# Altium schematic sheet EXT_SEC.SchDoc
size A2
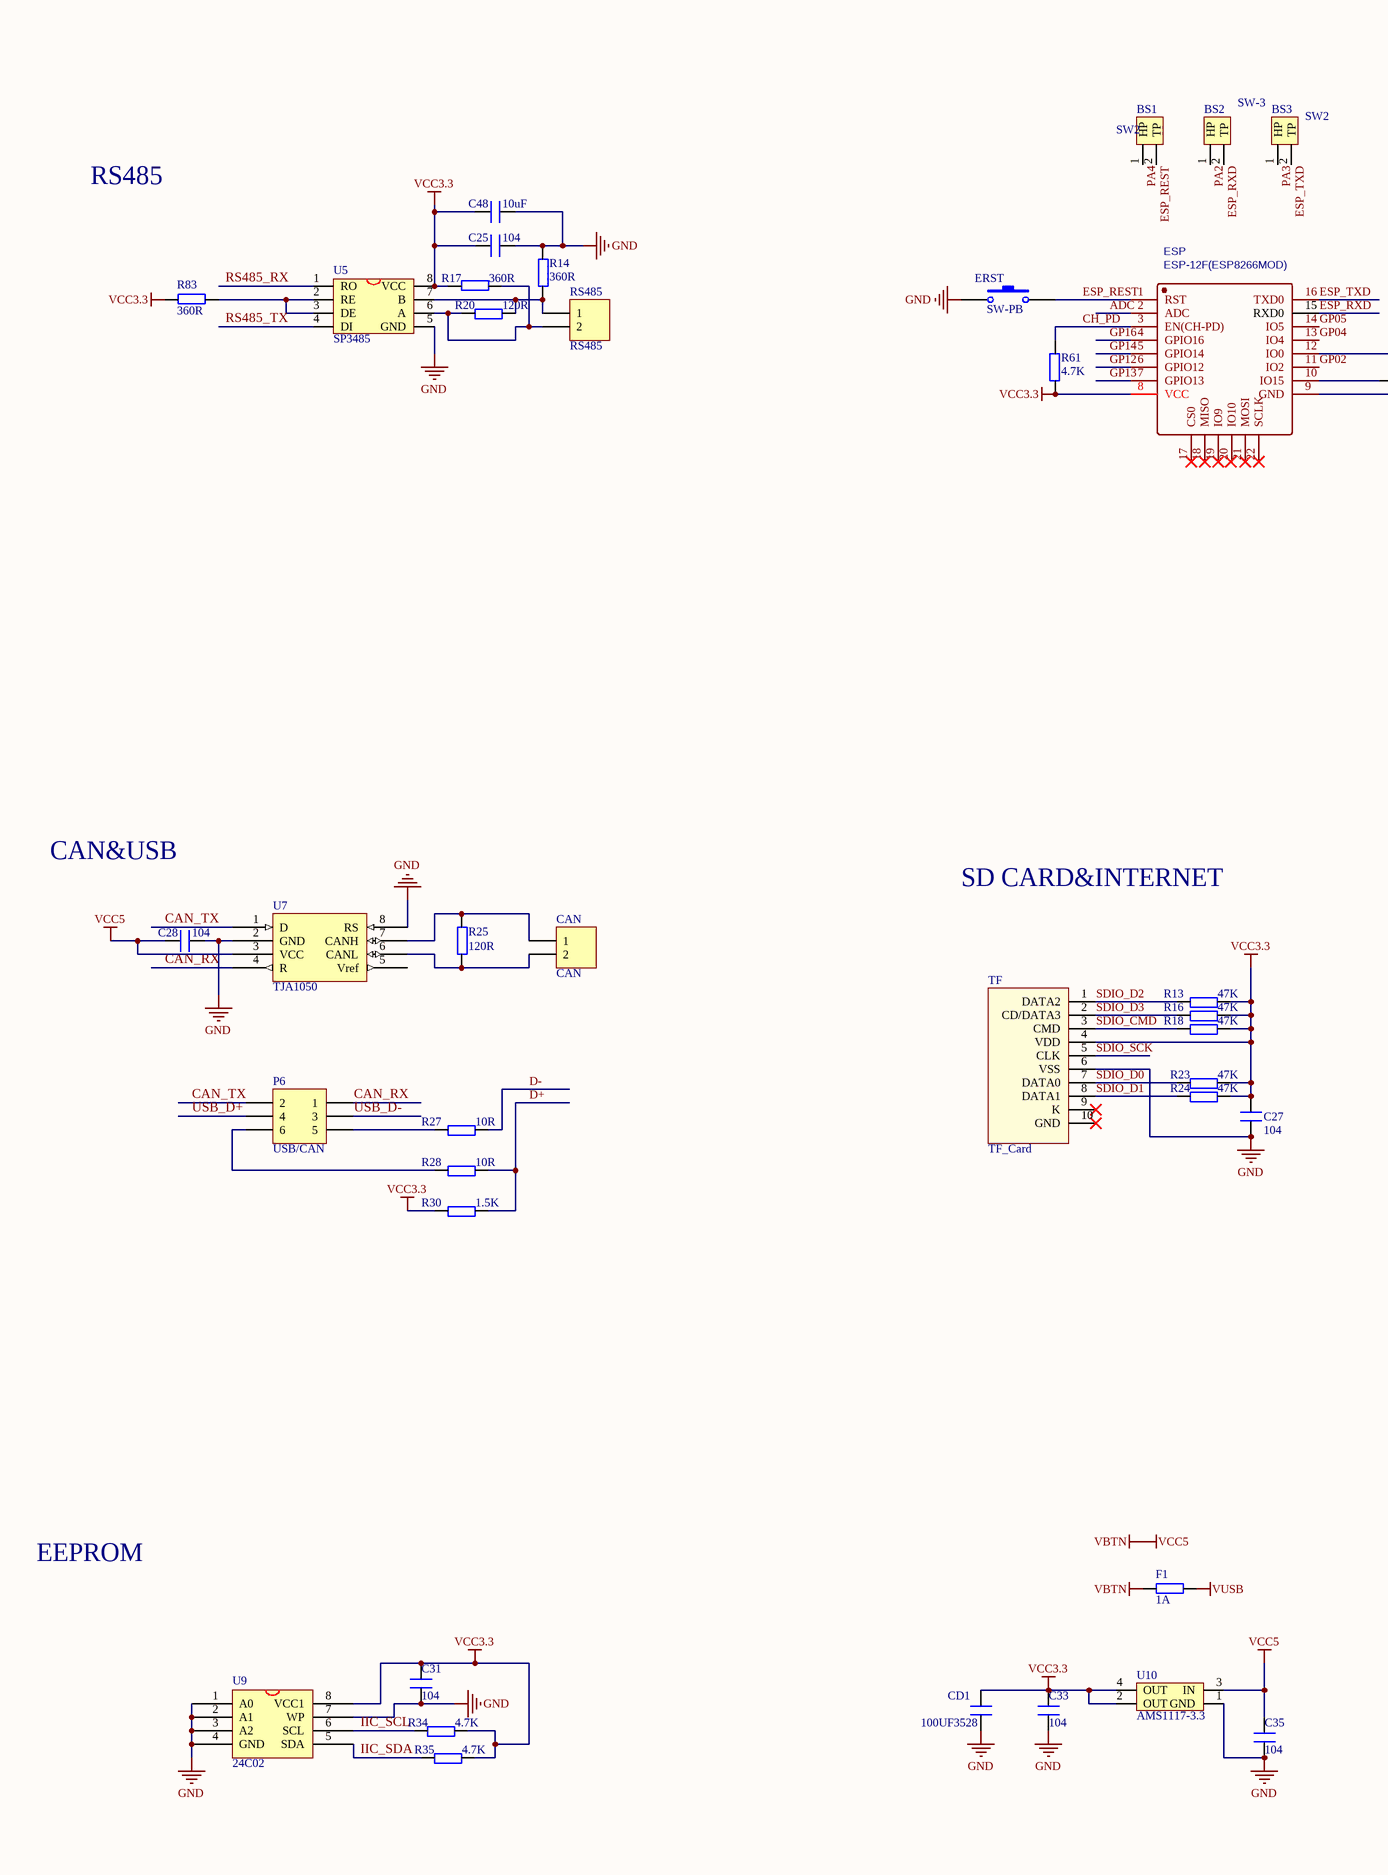
[diagram p0: EXT_SEC.SchDoc, left]
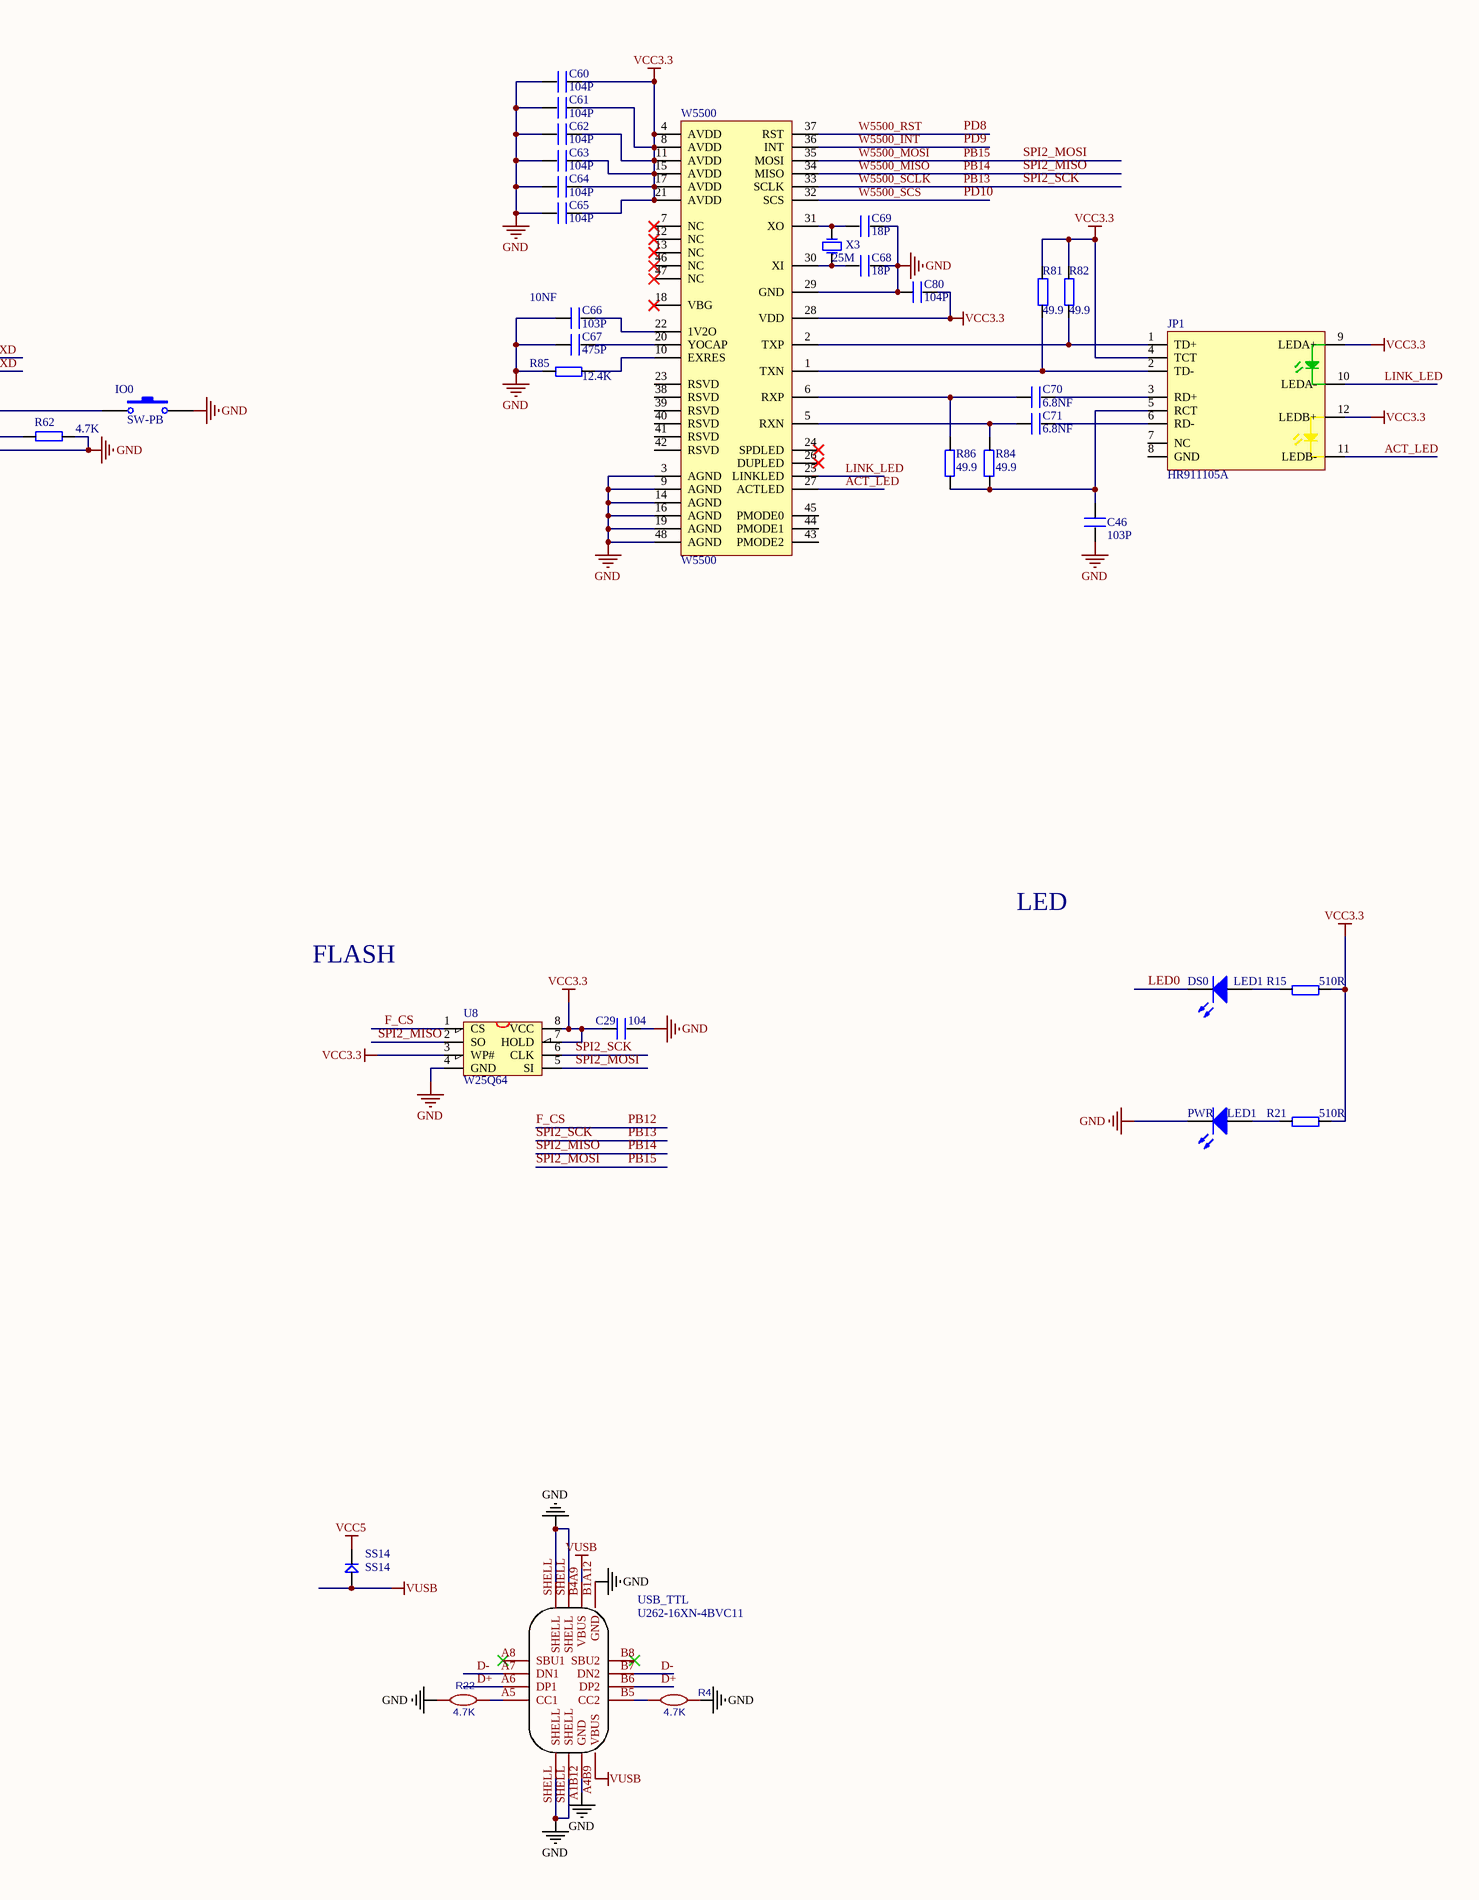
[diagram p1: EXT_SEC.SchDoc, right]

## Parts
BS1  SW2  [SW-2]
BS2  SW-3  [SW-2]
BS3  SW2  [SW-2]
C25  104  [0603CL]
C27  104  [0603CL]
C28  104  [0603CL]
C29  104  [0603CL]
C31  104  [0603CL]
C33  104  [0603CL]
C35  104  [0603CL]
C46  103P  [0603C]
C48  10uF  [0603CL]
C60  104P  [0603C]
C61  104P  [0603C]
C62  104P  [0603C]
C63  104P  [0603C]
C64  104P  [0603C]
C65  104P  [0603C]
C66  103P  [0603C]
C67  475P  [0603C]
C68  18P  [0603C]
C69  18P  [0603C]
C70  6.8NF  [0603C]
C71  6.8NF  [0603C]
C80  104P  [0603C]
CAN  CAN  [HEAD2L-0.8L]
CD1  100UF3528  [3528]
DS0  LED1  [0603d]
ERST  SW-PB  [SW2 - MINI1]
ESP  ESP-12F(ESP8266MOD)  [ESP12F]
F1  1A  [0805]
IO0  SW-PB  [SW2 - MINI1]
JP1  HR911105A  [HR911105A]
P6  USB/CAN  [HDR2X3L]
PWR  LED1  [0603d]
R4  4.7K  [R0603]
R13  47K  [0603L]
R14  360R  [0603L]
R15  510R  [0603L]
R16  47K  [0603L]
R17  360R  [0603L]
R18  47K  [0603L]
R20  120R  [0603L]
R21  510R  [0603L]
R22  4.7K  [R0603]
R23  47K  [0603L]
R24  47K  [0603L]
R25  120R  [0603L]
R27  10R  [0603L]
R28  10R  [0603L]
R30  1.5K  [0603L]
R34  4.7K  [0603L]
R35  4.7K  [0603L]
R61  4.7K  [0603R]
R62  4.7K  [0603R]
R81  49.9  [0603R]
R82  49.9  [0603R]
R83  360R  [0603L]
R84  49.9  [0603R]
R85  12.4K  [0603R]
R86  49.9  [0603R]
RS485  RS485  [HEAD2L-0.8L]
SS14  SS14  [SOD323D]
TF  TF_Card  [Micro SD]
U5  SP3485  [SOP-8L]
U7  TJA1050  [SOP-8L]
U8  W25Q64  [SOIC-8L]
U9  24C02  [SOP-8L]
U10  AMS1117-3.3  [SOT89]
USB_TTL  U262-16XN-4BVC11  [USB-C-SMD_TYPE-C16PIN]
W5500  W5500  [QFP-48]
X3  25M  [OSC-5032-2P]

## Nets
GND: C25.2 C27.1 C28.2 C29.2 C31.1 C33.1 C35.1 C46.2 C48.2 C60.2 C61.2 C62.2 C63.2 C64.2 C65.2 C66.2 C67.2 C68.1 C69.1 C80.2 CD1.A ERST.2 ESP.9(GND) IO0.1 PWR.2(K) R4.2 R14.2 R22.1 R62.1 R85.1 TF.6(VSS) U5.5(GND) U7.2(GND) U7.8(RS) U8.4(GND) U9.1(A0) U9.2(A1) U9.3(A2) U9.4(GND) U9.7(WP) U10.1(GND) USB_TTL.A1B12(GND) USB_TTL.B1A12(GND) USB_TTL.SHELL W5500.3(AGND) W5500.9(AGND) W5500.14(AGND) W5500.16(AGND) W5500.19(AGND) W5500.29(GND) W5500.48(AGND)
VBTN: C28.1 C35.2 F1.2 SS14.2 U7.3(VCC) U10.3(IN)  [also labelled VCC5]
VCC3.3: C25.1 C27.2 C29.1 C31.2 C33.2 C48.1 C60.1 C61.1 C62.1 C63.1 C64.1 C65.1 C80.1 CD1.K ESP.8(VCC) JP1.4(TCT) JP1.9(LEDA+) JP1.12(LEDB+) R13.2 R15.2 R16.2 R17.2 R18.2 R21.2 R23.2 R24.2 R30.1 R34.2 R35.2 R61.2 R81.2 R82.2 R83.2 TF.4(VDD) U5.8(VCC) U8.3(WP#) U8.7(HOLD) U8.8(VCC) U9.8(VCC1) U10.2(OUT) U10.4(OUT) W5500.4(AVDD) W5500.8(AVDD) W5500.11(AVDD) W5500.15(AVDD) W5500.17(AVDD) W5500.21(AVDD) W5500.28(VDD)
VUSB: F1.1 SS14.1 USB_TTL.A4B9(VBUS) USB_TTL.B4A9(VBUS)
ACT_LED: JP1.11(LEDB-) W5500.27(ACTLED)
ADC: ESP.2(ADC)
CAN_RX: P6.1 U7.4(R)
CAN_TX: P6.2 U7.1(D)
CH_PD: ESP.3(EN(CH-PD)) R61.1
D+: R28.2 R30.2 USB_TTL.A6(DP1) USB_TTL.B6(DP2)
D-: R27.2 USB_TTL.A7(DN1) USB_TTL.B7(DN2)
ESP_REST: BS1.2(TP) ERST.1 ESP.1(RST)
ESP_RXD: BS2.2(TP) ESP.15(RXD0)
ESP_TXD: BS3.2(TP) ESP.16(TXD0)
F_CS: U8.1(CS)  [also labelled PB12]
GP02: ESP.11(IO2)
GP04: ESP.13(IO4)
GP05: ESP.14(IO5)
GP12: ESP.6(GPIO12)
GP13: ESP.7(GPIO13)
GP14: ESP.5(GPIO14)
GP16: ESP.4(GPIO16)
IIC_SCL: R34.1 U9.6(SCL)
IIC_SDA: R35.1 U9.5(SDA)
LED0: DS0.2(K)
LINK_LED: JP1.10(LEDA-) W5500.25(LINKLED)
PA2: BS2.1(HP)
PA3: BS3.1(HP)
PA4: BS1.1(HP)
PB13: U8.6(CLK) W5500.33(SCLK)  [also labelled SPI2_SCK, W5500_SCLK]
PB14: U8.2(SO) W5500.34(MISO)  [also labelled SPI2_MISO, W5500_MISO]
PB15: U8.5(SI) W5500.35(MOSI)  [also labelled SPI2_MOSI, W5500_MOSI]
PD8: W5500.37(RST)  [also labelled W5500_RST]
PD9: W5500.36(INT)  [also labelled W5500_INT]
PD10: W5500.32(SCS)  [also labelled W5500_SCS]
RS485_RX: U5.1(RO)
RS485_TX: U5.4(DI)
SDIO_CMD: R18.1 TF.3(CMD)
SDIO_D0: R23.1 TF.7(DATA0)
SDIO_D1: R24.1 TF.8(DATA1)
SDIO_D2: R13.1 TF.1(DATA2)
SDIO_D3: R16.1 TF.2(CD/DATA3)
SDIO_SCK: TF.5(CLK)
USB_D+: P6.4
USB_D-: P6.3
NetC46_1: C46.1 JP1.5(RCT) R84.2 R86.2
NetC66_1: C66.1 W5500.22(1V2O)
NetC67_1: C67.1 W5500.20(YOCAP)
NetC68_2: C68.2 W5500.30(XI) X3.1(OSC1)
NetC69_2: C69.2 W5500.31(XO) X3.2(OSC2)
NetC70_1: C70.1 JP1.3(RD+)
NetC70_2: C70.2 R86.1 W5500.6(RXP)
NetC71_1: C71.1 JP1.6(RD-)
NetC71_2: C71.2 R84.1 W5500.5(RXN)
NetCAN_1: CAN.1 R25.2 U7.7(CANH)
NetCAN_2: CAN.2 R25.1 U7.6(CANL)
NetDS0_1: DS0.1(A) R15.1
NetESP_10: ESP.10(IO15) R62.2
NetESP_12: ESP.12(IO0) IO0.2
NetJP1_1: JP1.1(TD+) R82.1 W5500.2(TXP)
NetJP1_2: JP1.2(TD-) R81.1 W5500.1(TXN)
NetP6_5: P6.5 R27.1
NetP6_6: P6.6 R28.1
NetPWR_1: PWR.1(A) R21.1
NetR4_1: R4.1 USB_TTL.B5(CC2)
NetR14_1: R14.1 R20.2 RS485.1 U5.7(B)
NetR17_1: R17.1 R20.1 RS485.2 U5.6(A)
NetR22_2: R22.2 USB_TTL.A5(CC1)
NetR83_1: R83.1 U5.2(RE) U5.3(DE)
NetR85_2: R85.2 W5500.10(EXRES)

Not connected (* = marked no-connect by the designer): ESP 17(CS0)* 18(MISO)* 19(IO9)* 20(IO10) 21(MOSI)* 22(SCLK)*; JP1 7(NC) 8(GND); TF 9(K)* 10(GND)*; U7 5(Vref); USB_TTL A8(SBU1)* B8(SBU2)*; W5500 7(NC)* 12(NC)* 13(NC)* 18(VBG)* 23(RSVD) 24(SPDLED)* 26(DUPLED)* 38(RSVD) 39(RSVD) 40(RSVD) 41(RSVD) 42(RSVD) 43(PMODE2) 44(PMODE1) 45(PMODE0) 46(NC)* 47(NC)*

## Notes on the sheet
- RS485
- (near C66) 10NF
- CAN&USB
- SD CARD&INTERNET
- LED
- FLASH
- EEPROM

## Library data of the parts
BS1 BS3 = SW2: SW-3
BS2 = SW2
C25 C27-C29 C31 C33 C35 C48 CD1 = C
C46 C60-C71 C80 = C: 风华 0603B103K500NT
CAN RS485 = Header 2: Header, 2-Pin; LatestRevisionDate: 17-Jul-2002; LatestRevisionNote: Re-released for DXP Platform.; Publisher: Altium Limited
DS0 PWR = LED2: Typical RED, GREEN, YELLOW, AMBER GaAs LED; Published: 8-Jun-2000; LatestRevisionDate: 17-Jul-2002; LatestRevisionNote: Re-released for DXP Platform.; PackageDocument: Feb-2002; PackageReference: 3.2X1.6X1.1; Publisher: Altium Limited
ERST IO0 = SW-PB: Switch; Published: 24-Mar-1999; LatestRevisionDate: 17-Jul-2002; LatestRevisionNote: Re-released for DXP Platform.; PackageReference: SPST-2; Publisher: Altium Limited
ESP = ESP-12F(ESP8266MOD): BOM_Manufacturer: Ai-Thinker; BOM_Paste Type: recommend; BOM_Assembly Type: smtWeld; BOM_Supplier: LCSC; BOM_Manufacturer Part: ESP-12F(ESP8266MOD); BOM_Supplier Part: C82891; spicePre: U; spiceSymbolName: ESP-12F(ESP8266MOD)
F1 R13-R18 R20 R21 R23-R25 R27 R28 R30 R34 R35 R61 R62 R81-R86 = R
P6 = Header 3X2: Header, 3-Pin, Dual row; LatestRevisionDate: 17-Jul-2002; LatestRevisionNote: Re-released for DXP Platform.; Publisher: Altium Limited
R4 R22 = 5.1K: BOM_Manufacturer: Tyohm; BOM_Manufacturer Part: RMC06035.1K5%N; nameAlias: Resistance (Ohms); Contributor: LCSC; BOM_Supplier: LCSC; BOM_Supplier Part: C269696; spicePre: R; spiceSymbolName: RMC06035.1K5%N; BOM_JLCPCB Part Class: Extended Part
SS14 = D: 1N4148
TF = TF_Card: TF卡座; 版权归属: 源创客; BOM名称: TF卡座; 学习资源: www.ooocke.com
U5 = MAX3485
U7 = SN65HVD230D
U8 = W25X16: W25X16;SST25VF016;MX25L1605
U9 = 24C256
U10 = AMS1117
USB_TTL = U262-16XN-4BVC11: BOM_Manufacturer: XKB Enterprise; Contributor: LCSC; BOM_Supplier: LCSC; BOM_Supplier Part: C319148; BOM_Manufacturer Part: U262-16XN-4BVC11; BOM_JLCPCB Part Class: Extended Part; spicePre: U; spiceSymbolName: U262-16XN-4BVC11
X3 = XTAL_1: Crystal Oscillator; Published: 8-Jun-2000; LatestRevisionDate: 17-Jul-2002; LatestRevisionNote: Re-released for DXP Platform.; Publisher: Altium Limited